# Altium project KeyBoardV2.PrjPcb
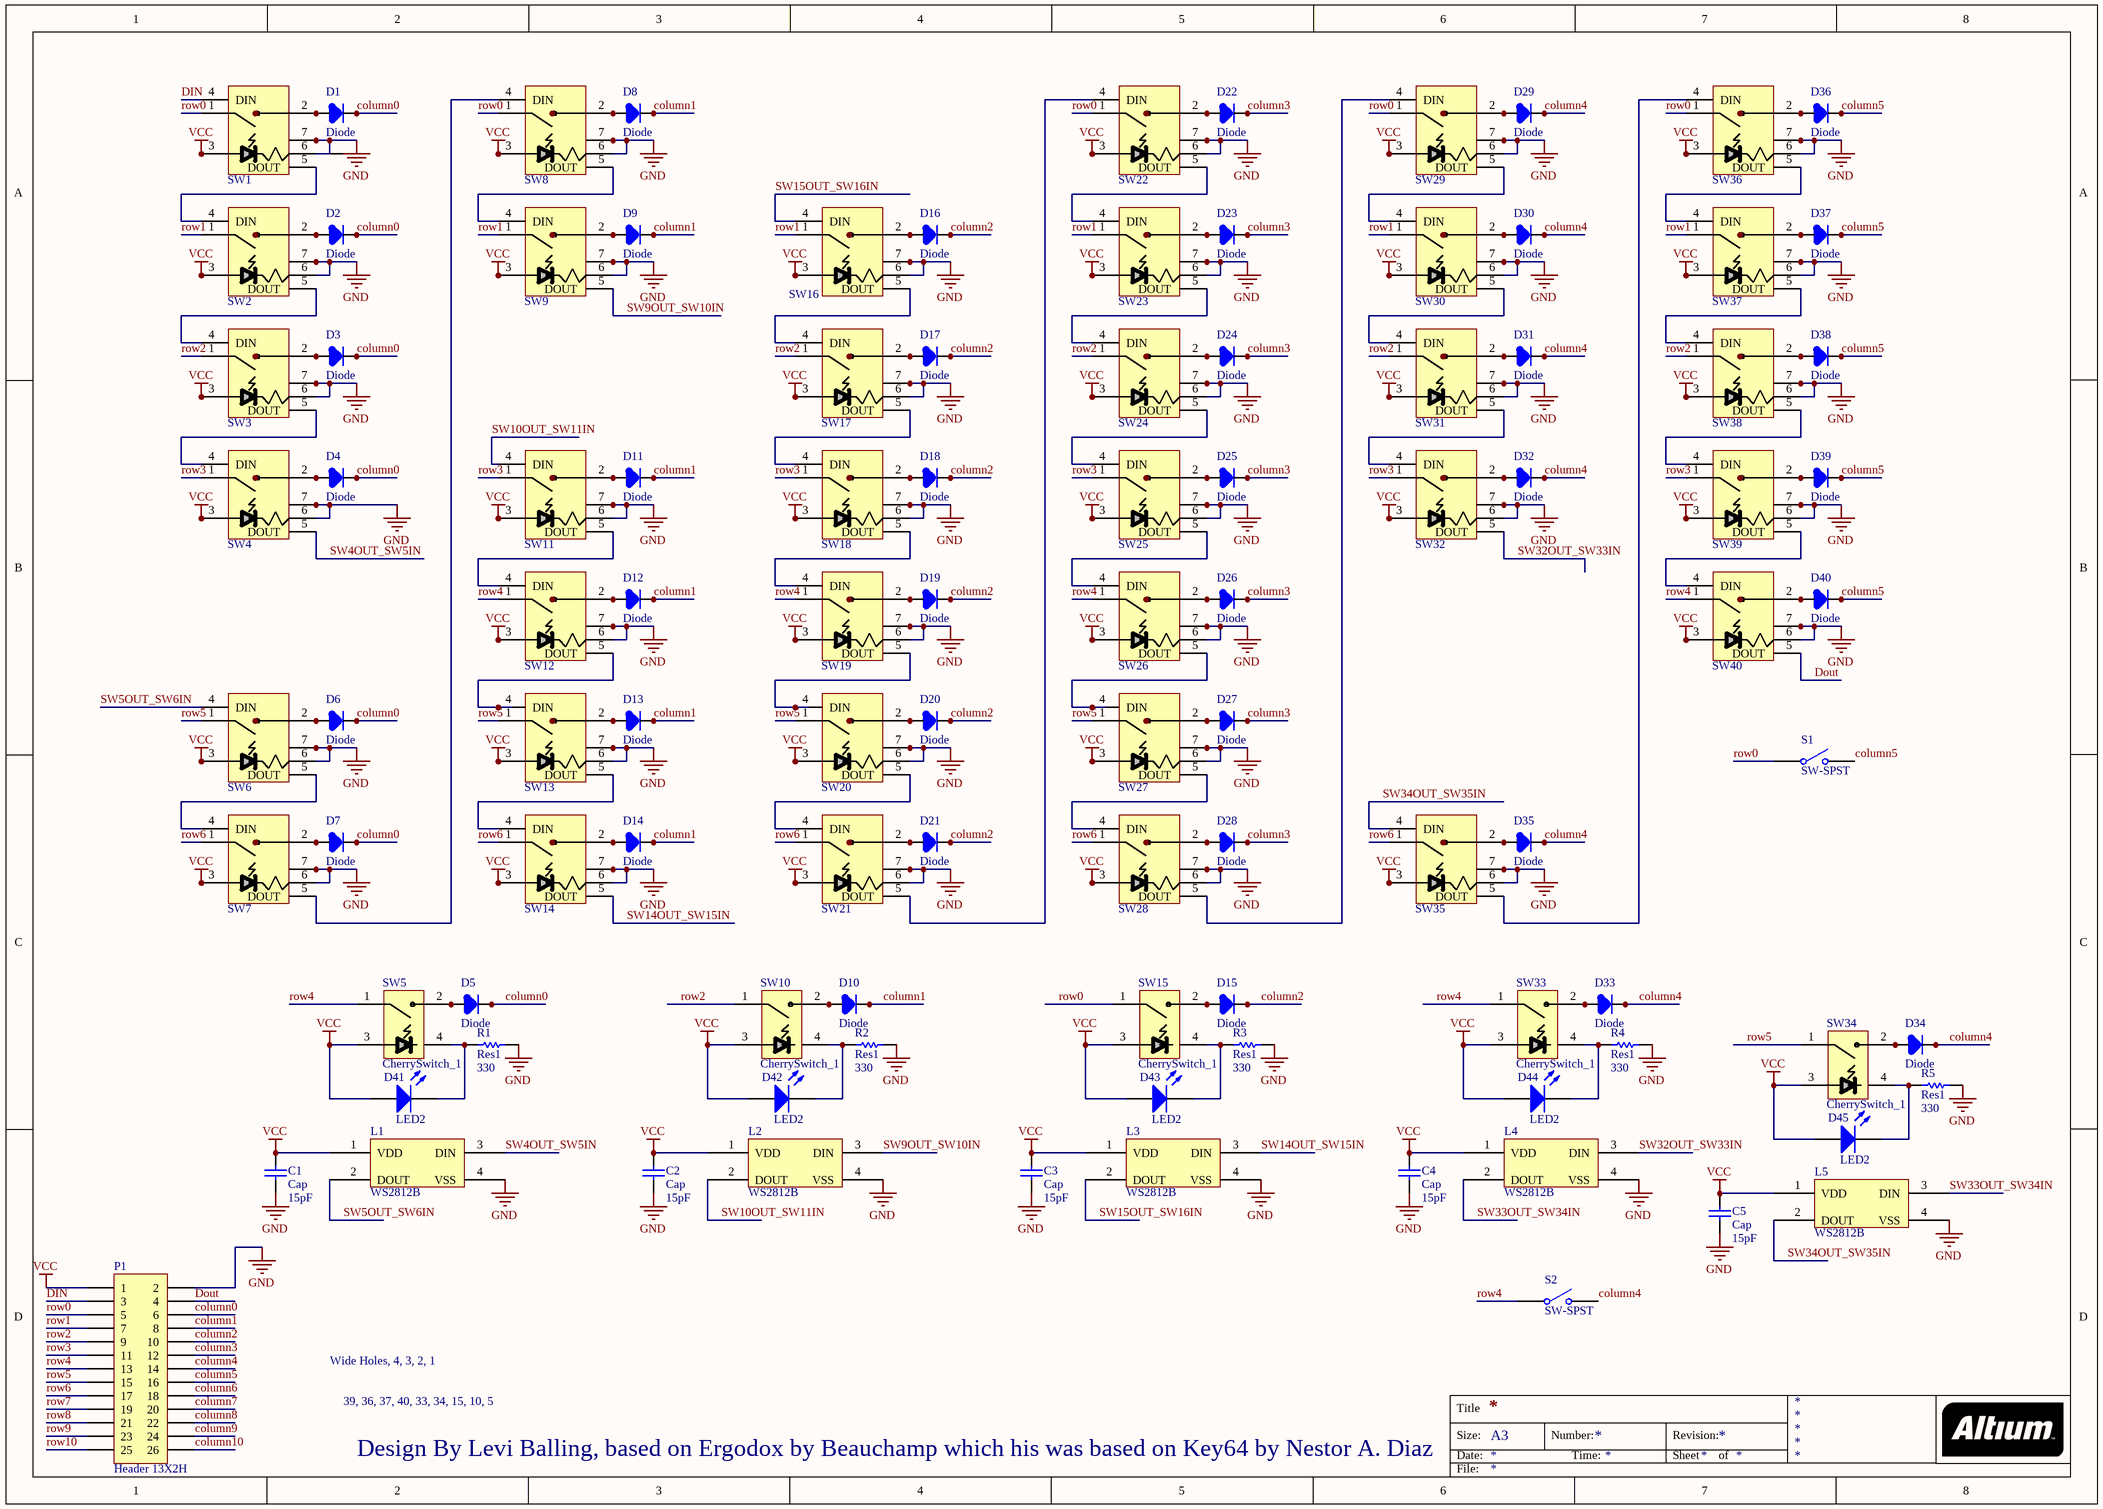
[diagram p0: keyboard.SchDoc]
1 sheet, 103 parts. Net scope: global (net labels, ports and power ports of the same name join across sheets).
Board file: Mickeyboard2.PcbDoc

## Sheet keyboard.SchDoc
size A3

### Parts
C1  Cap  value 15pF  [AxialSMDCap]
C2  Cap  value 15pF  [AxialSMDCap]
C3  Cap  value 15pF  [AxialSMDCap]
C4  Cap  value 15pF  [AxialSMDCap]
C5  Cap  value 15pF  [AxialSMDCap]
D1  Diode  [AxialSMDDiode]
D2  Diode  [AxialSMDDiode]
D3  Diode  [AxialSMDDiode]
D4  Diode  [AxialSMDDiode]
D5  Diode  [AxialSMDDiode]
D6  Diode  [AxialSMDDiode]
D7  Diode  [AxialSMDDiode]
D8  Diode  [AxialSMDDiode]
D9  Diode  [AxialSMDDiode]
D10  Diode  [AxialSMDDiode]
D11  Diode  [AxialSMDDiode]
D12  Diode  [AxialSMDDiode]
D13  Diode  [AxialSMDDiode]
D14  Diode  [AxialSMDDiode]
D15  Diode  [AxialSMDDiode]
D16  Diode  [AxialSMDDiode]
D17  Diode  [AxialSMDDiode]
D18  Diode  [AxialSMDDiode]
D19  Diode  [AxialSMDDiode]
D20  Diode  [AxialSMDDiode]
D21  Diode  [AxialSMDDiode]
D22  Diode  [AxialSMDDiode]
D23  Diode  [AxialSMDDiode]
D24  Diode  [AxialSMDDiode]
D25  Diode  [AxialSMDDiode]
D26  Diode  [AxialSMDDiode]
D27  Diode  [AxialSMDDiode]
D28  Diode  [AxialSMDDiode]
D29  Diode  [AxialSMDDiode]
D30  Diode  [AxialSMDDiode]
D31  Diode  [AxialSMDDiode]
D32  Diode  [AxialSMDDiode]
D33  Diode  [AxialSMDDiode]
D34  Diode  [AxialSMDDiode]
D35  Diode  [AxialSMDDiode]
D36  Diode  [AxialSMDDiode]
D37  Diode  [AxialSMDDiode]
D38  Diode  [AxialSMDDiode]
D39  Diode  [AxialSMDDiode]
D40  Diode  [AxialSMDDiode]
D41  LED2  [0805_LED]
D42  LED2  [0805_LED]
D43  LED2  [0805_LED]
D44  LED2  [0805_LED]
D45  LED2  [0805_LED]
L1  WS2812B  [WS2812]
L2  WS2812B  [WS2812]
L3  WS2812B  [WS2812]
L4  WS2812B  [WS2812]
L5  WS2812B  [WS2812]
P1  Header 13X2H  [HDR2X13H]
R1  Res1  value 330  [AxialSMDResistor]
R2  Res1  value 330  [AxialSMDResistor]
R3  Res1  value 330  [AxialSMDResistor]
R4  Res1  value 330  [AxialSMDResistor]
R5  Res1  value 330  [AxialSMDResistor]
S1  SW-SPST  [CherryMxSwitchNoLED]
S2  SW-SPST  [CherryMxSwitchNoLED]
SW1  CherrySwitch_WS  [CherryMxSwitchLED_WS2812]  (value not drawn)
SW2  CherrySwitch_WS  [CherryMxSwitchLED_WS2812]  (value not drawn)
SW3  CherrySwitch_WS  [CherryMxSwitchLED_WS2812]  (value not drawn)
SW4  CherrySwitch_WS  [CherryMxSwitchLED_WS2812]  (value not drawn)
SW5  CherrySwitch_1  [CherryMxSwitchNOSMD]
SW6  CherrySwitch_WS  [CherryMxSwitchLED_WS2812]  (value not drawn)
SW7  CherrySwitch_WS  [CherryMxSwitchLED_WS2812]  (value not drawn)
SW8  CherrySwitch_WS  [CherryMxSwitchLED_WS2812]  (value not drawn)
SW9  CherrySwitch_WS  [CherryMxSwitchLED_WS2812]  (value not drawn)
SW10  CherrySwitch_1  [CherryMxSwitchNOSMD]
SW11  CherrySwitch_WS  [CherryMxSwitchLED_WS2812]  (value not drawn)
SW12  CherrySwitch_WS  [CherryMxSwitchLED_WS2812]  (value not drawn)
SW13  CherrySwitch_WS  [CherryMxSwitchLED_WS2812]  (value not drawn)
SW14  CherrySwitch_WS  [CherryMxSwitchLED_WS2812]  (value not drawn)
SW15  CherrySwitch_1  [CherryMxSwitchNOSMD]
SW16  CherrySwitch_WS  [CherryMxSwitchLED_WS2812]  (value not drawn)
SW17  CherrySwitch_WS  [CherryMxSwitchLED_WS2812]  (value not drawn)
SW18  CherrySwitch_WS  [CherryMxSwitchLED_WS2812]  (value not drawn)
SW19  CherrySwitch_WS  [CherryMxSwitchLED_WS2812]  (value not drawn)
SW20  CherrySwitch_WS  [CherryMxSwitchLED_WS2812]  (value not drawn)
SW21  CherrySwitch_WS  [CherryMxSwitchLED_WS2812]  (value not drawn)
SW22  CherrySwitch_WS  [CherryMxSwitchLED_WS2812]  (value not drawn)
SW23  CherrySwitch_WS  [CherryMxSwitchLED_WS2812]  (value not drawn)
SW24  CherrySwitch_WS  [CherryMxSwitchLED_WS2812]  (value not drawn)
SW25  CherrySwitch_WS  [CherryMxSwitchLED_WS2812]  (value not drawn)
SW26  CherrySwitch_WS  [CherryMxSwitchLED_WS2812]  (value not drawn)
SW27  CherrySwitch_WS  [CherryMxSwitchLED_WS2812]  (value not drawn)
SW28  CherrySwitch_WS  [CherryMxSwitchLED_WS2812]  (value not drawn)
SW29  CherrySwitch_WS  [CherryMxSwitchLED_WS2812]  (value not drawn)
SW30  CherrySwitch_WS  [CherryMxSwitchLED_WS2812]  (value not drawn)
SW31  CherrySwitch_WS  [CherryMxSwitchLED_WS2812]  (value not drawn)
SW32  CherrySwitch_WS  [CherryMxSwitchLED_WS2812]  (value not drawn)
SW33  CherrySwitch_1  [CherryMxSwitchNOSMD]
SW34  CherrySwitch_1  [CherryMxSwitchNOSMD]
SW35  CherrySwitch_WS  [CherryMxSwitchLED_WS2812]  (value not drawn)
SW36  CherrySwitch_WS  [CherryMxSwitchLED_WS2812]  (value not drawn)
SW37  CherrySwitch_WS  [CherryMxSwitchLED_WS2812]  (value not drawn)
SW38  CherrySwitch_WS  [CherryMxSwitchLED_WS2812]  (value not drawn)
SW39  CherrySwitch_WS  [CherryMxSwitchLED_WS2812]  (value not drawn)
SW40  CherrySwitch_WS  [CherryMxSwitchLED_WS2812]  (value not drawn)

### Nets
6: SW2.8 SW3.8 SW4.8 SW6.8 SW7.8 SW8.8 SW9.8 SW11.8 SW12.8 SW13.8 SW14.8 SW16.8 SW17.8 SW18.8 SW19.8 SW20.8 SW21.8 SW22.8 SW23.8 SW24.8 SW25.8 SW26.8 SW27.8 SW28.8 SW29.8 SW30.8 SW31.8 SW32.8 SW35.8 SW36.8 SW37.8 SW38.8 SW39.8 SW40.8
GND: C1.1 C2.1 C3.1 C4.1 C5.1 L1.4(VSS) L2.4(VSS) L3.4(VSS) L4.4(VSS) L5.4(VSS) P1.2 R1.2 R2.2 R3.2 R4.2 R5.2 SW1.6(GND) SW1.7(GND) SW1.17 SW1.18 SW2.6(GND) SW2.7(GND) SW2.17 SW2.18 SW3.6(GND) SW3.7(GND) SW3.17 SW3.18 SW4.6(GND) SW4.7(GND) SW4.17 SW4.18 SW6.6(GND) SW6.7(GND) SW6.17 SW6.18 SW7.6(GND) SW7.7(GND) SW7.17 SW7.18 SW8.6(GND) SW8.7(GND) SW8.17 SW8.18 SW9.6(GND) SW9.7(GND) SW9.17 SW9.18 SW11.6(GND) SW11.7(GND) SW11.17 SW11.18 SW12.6(GND) SW12.7(GND) SW12.17 SW12.18 SW13.6(GND) SW13.7(GND) SW13.17 SW13.18 SW14.6(GND) SW14.7(GND) SW14.17 SW14.18 SW16.6(GND) SW16.7(GND) SW16.17 SW16.18 SW17.6(GND) SW17.7(GND) SW17.17 SW17.18 SW18.6(GND) SW18.7(GND) SW18.17 SW18.18 SW19.6(GND) SW19.7(GND) SW19.17 SW19.18 SW20.6(GND) SW20.7(GND) SW20.17 SW20.18 SW21.6(GND) SW21.7(GND) SW21.17 SW21.18 SW22.6(GND) SW22.7(GND) SW22.17 SW22.18 SW23.6(GND) SW23.7(GND) SW23.17 SW23.18 SW24.6(GND) SW24.7(GND) SW24.17 SW24.18 SW25.6(GND) SW25.7(GND) SW25.17 SW25.18 SW26.6(GND) SW26.7(GND) SW26.17 SW26.18 SW27.6(GND) SW27.7(GND) SW27.17 SW27.18 SW28.6(GND) SW28.7(GND) SW28.17 SW28.18 SW29.6(GND) SW29.7(GND) SW29.17 SW29.18 SW30.6(GND) SW30.7(GND) SW30.17 SW30.18 SW31.6(GND) SW31.7(GND) SW31.17 SW31.18 SW32.6(GND) SW32.7(GND) SW32.17 SW32.18 SW35.6(GND) SW35.7(GND) SW35.17 SW35.18 SW36.6(GND) SW36.7(GND) SW36.17 SW36.18 SW37.6(GND) SW37.7(GND) SW37.17 SW37.18 SW38.6(GND) SW38.7(GND) SW38.17 SW38.18 SW39.6(GND) SW39.7(GND) SW39.17 SW39.18 SW40.6(GND) SW40.7(GND) SW40.17 SW40.18
VCC: C1.2 C2.2 C3.2 C4.2 C5.2 D41.1(A) D42.1(A) D43.1(A) D44.1(A) D45.1(A) L1.1(VDD) L2.1(VDD) L3.1(VDD) L4.1(VDD) L5.1(VDD) P1.1 SW1.3 SW1.9 SW1.10 SW1.11 SW1.12 SW2.3 SW2.9 SW2.10 SW2.11 SW2.12 SW3.3 SW3.9 SW3.10 SW3.11 SW3.12 SW4.3 SW4.9 SW4.10 SW4.11 SW4.12 SW5.3 SW6.3 SW6.9 SW6.10 SW6.11 SW6.12 SW7.3 SW7.9 SW7.10 SW7.11 SW7.12 SW8.3 SW8.9 SW8.10 SW8.11 SW8.12 SW9.3 SW9.9 SW9.10 SW9.11 SW9.12 SW10.3 SW11.3 SW11.9 SW11.10 SW11.11 SW11.12 SW12.3 SW12.9 SW12.10 SW12.11 SW12.12 SW13.3 SW13.9 SW13.10 SW13.11 SW13.12 SW14.3 SW14.9 SW14.10 SW14.11 SW14.12 SW15.3 SW16.3 SW16.9 SW16.10 SW16.11 SW16.12 SW17.3 SW17.9 SW17.10 SW17.11 SW17.12 SW18.3 SW18.9 SW18.10 SW18.11 SW18.12 SW19.3 SW19.9 SW19.10 SW19.11 SW19.12 SW20.3 SW20.9 SW20.10 SW20.11 SW20.12 SW21.3 SW21.9 SW21.10 SW21.11 SW21.12 SW22.3 SW22.9 SW22.10 SW22.11 SW22.12 SW23.3 SW23.9 SW23.10 SW23.11 SW23.12 SW24.3 SW24.9 SW24.10 SW24.11 SW24.12 SW25.3 SW25.9 SW25.10 SW25.11 SW25.12 SW26.3 SW26.9 SW26.10 SW26.11 SW26.12 SW27.3 SW27.9 SW27.10 SW27.11 SW27.12 SW28.3 SW28.9 SW28.10 SW28.11 SW28.12 SW29.3 SW29.9 SW29.10 SW29.11 SW29.12 SW30.3 SW30.9 SW30.10 SW30.11 SW30.12 SW31.3 SW31.9 SW31.10 SW31.11 SW31.12 SW32.3 SW32.9 SW32.10 SW32.11 SW32.12 SW33.3 SW34.3 SW35.3 SW35.9 SW35.10 SW35.11 SW35.12 SW36.3 SW36.9 SW36.10 SW36.11 SW36.12 SW37.3 SW37.9 SW37.10 SW37.11 SW37.12 SW38.3 SW38.9 SW38.10 SW38.11 SW38.12 SW39.3 SW39.9 SW39.10 SW39.11 SW39.12 SW40.3 SW40.9 SW40.10 SW40.11 SW40.12
column0: D1.2 D1.4 D2.2 D2.4 D3.2 D3.4 D4.2 D4.4 D5.2 D5.4 D6.2 D6.4 D7.2 D7.4 P1.6
column1: D8.2 D8.4 D9.2 D9.4 D10.2 D10.4 D11.2 D11.4 D12.2 D12.4 D13.2 D13.4 D14.2 D14.4 P1.8
column2: D15.2 D15.4 D16.2 D16.4 D17.2 D17.4 D18.2 D18.4 D19.2 D19.4 D20.2 D20.4 D21.2 D21.4 P1.10
column3: D22.2 D22.4 D23.2 D23.4 D24.2 D24.4 D25.2 D25.4 D26.2 D26.4 D27.2 D27.4 D28.2 D28.4 P1.12
column4: D29.2 D29.4 D30.2 D30.4 D31.2 D31.4 D32.2 D32.4 D33.2 D33.4 D34.2 D34.4 D35.2 D35.4 P1.14 S2.2(NO)
column5: D36.2 D36.4 D37.2 D37.4 D38.2 D38.4 D39.2 D39.4 D40.2 D40.4 P1.16 S1.2(NO)
column6: P1.18
column7: P1.20
column8: P1.22
column9: P1.24
column10: P1.26
DIN: P1.3 SW1.4(DIN)
Dout: P1.4 SW40.5(DOUT)
row0: P1.5 S1.1(COMMON) SW1.1 SW8.1 SW15.1 SW22.1 SW29.1 SW36.1
row1: P1.7 SW2.1 SW9.1 SW16.1 SW23.1 SW30.1 SW37.1
row2: P1.9 SW3.1 SW10.1 SW17.1 SW24.1 SW31.1 SW38.1
row3: P1.11 SW4.1 SW11.1 SW18.1 SW25.1 SW32.1 SW39.1
row4: P1.13 S2.1(COMMON) SW5.1 SW12.1 SW19.1 SW26.1 SW33.1 SW40.1
row5: P1.15 SW6.1 SW13.1 SW20.1 SW27.1 SW34.1
row6: P1.17 SW7.1 SW14.1 SW21.1 SW28.1 SW35.1
row7: P1.19
row8: P1.21
row9: P1.23
row10: P1.25
SW4OUT_SW5IN: L1.3(DIN) SW4.5(DOUT)
SW5OUT_SW6IN: L1.2(DOUT) SW6.4(DIN)
SW9OUT_SW10IN: L2.3(DIN) SW9.5(DOUT)
SW10OUT_SW11IN: L2.2(DOUT) SW11.4(DIN)
SW14OUT_SW15IN: L3.3(DIN) SW14.5(DOUT)
SW15OUT_SW16IN: L3.2(DOUT) SW16.4(DIN)
SW32OUT_SW33IN: L4.3(DIN) SW32.5(DOUT)
SW33OUT_SW34IN: L4.2(DOUT) L5.3(DIN)
SW34OUT_SW35IN: L5.2(DOUT) SW35.4(DIN)
NetD1_1: D1.1 D1.3 SW1.2
NetD2_1: D2.1 D2.3 SW2.2
NetD3_1: D3.1 D3.3 SW3.2
NetD4_1: D4.1 D4.3 SW4.2
NetD5_1: D5.1 D5.3 SW5.2
NetD6_1: D6.1 D6.3 SW6.2
NetD7_1: D7.1 D7.3 SW7.2
NetD8_1: D8.1 D8.3 SW8.2
NetD9_1: D9.1 D9.3 SW9.2
NetD10_1: D10.1 D10.3 SW10.2
NetD11_1: D11.1 D11.3 SW11.2
NetD12_1: D12.1 D12.3 SW12.2
NetD13_1: D13.1 D13.3 SW13.2
NetD14_1: D14.1 D14.3 SW14.2
NetD15_1: D15.1 D15.3 SW15.2
NetD16_1: D16.1 D16.3 SW16.2
NetD17_1: D17.1 D17.3 SW17.2
NetD18_1: D18.1 D18.3 SW18.2
NetD19_1: D19.1 D19.3 SW19.2
NetD20_1: D20.1 D20.3 SW20.2
NetD21_1: D21.1 D21.3 SW21.2
NetD22_1: D22.1 D22.3 SW22.2
NetD23_1: D23.1 D23.3 SW23.2
NetD24_1: D24.1 D24.3 SW24.2
NetD25_1: D25.1 D25.3 SW25.2
NetD26_1: D26.1 D26.3 SW26.2
NetD27_1: D27.1 D27.3 SW27.2
NetD28_1: D28.1 D28.3 SW28.2
NetD29_1: D29.1 D29.3 SW29.2
NetD30_1: D30.1 D30.3 SW30.2
NetD31_1: D31.1 D31.3 SW31.2
NetD32_1: D32.1 D32.3 SW32.2
NetD33_1: D33.1 D33.3 SW33.2
NetD34_1: D34.1 D34.3 SW34.2
NetD35_1: D35.1 D35.3 SW35.2
NetD36_1: D36.1 D36.3 SW36.2
NetD37_1: D37.1 D37.3 SW37.2
NetD38_1: D38.1 D38.3 SW38.2
NetD39_1: D39.1 D39.3 SW39.2
NetD40_1: D40.1 D40.3 SW40.2
NetD41_2: D41.2(K) R1.1 SW5.4
NetD42_2: D42.2(K) R2.1 SW10.4
NetD43_2: D43.2(K) R3.1 SW15.4
NetD44_2: D44.2(K) R4.1 SW33.4
NetD45_2: D45.2(K) R5.1 SW34.4
NetSW1_5: SW1.5(DOUT) SW2.4(DIN)
NetSW1_13: SW1.13 SW1.14 SW1.15 SW1.16
NetSW2_5: SW2.5(DOUT) SW3.4(DIN)
NetSW2_13: SW2.13 SW2.14 SW2.15 SW2.16
NetSW3_5: SW3.5(DOUT) SW4.4(DIN)
NetSW3_13: SW3.13 SW3.14 SW3.15 SW3.16
NetSW4_13: SW4.13 SW4.14 SW4.15 SW4.16
NetSW6_5: SW6.5(DOUT) SW7.4(DIN)
NetSW6_13: SW6.13 SW6.14 SW6.15 SW6.16
NetSW7_5: SW7.5(DOUT) SW8.4(DIN)
NetSW7_13: SW7.13 SW7.14 SW7.15 SW7.16
NetSW8_5: SW8.5(DOUT) SW9.4(DIN)
NetSW8_13: SW8.13 SW8.14 SW8.15 SW8.16
NetSW9_13: SW9.13 SW9.14 SW9.15 SW9.16
NetSW11_5: SW11.5(DOUT) SW12.4(DIN)
NetSW11_13: SW11.13 SW11.14 SW11.15 SW11.16
NetSW12_5: SW12.5(DOUT) SW13.4(DIN)
NetSW12_13: SW12.13 SW12.14 SW12.15 SW12.16
NetSW13_5: SW13.5(DOUT) SW14.4(DIN)
NetSW13_13: SW13.13 SW13.14 SW13.15 SW13.16
NetSW14_13: SW14.13 SW14.14 SW14.15 SW14.16
NetSW16_5: SW16.5(DOUT) SW17.4(DIN)
NetSW16_13: SW16.13 SW16.14 SW16.15 SW16.16
NetSW17_5: SW17.5(DOUT) SW18.4(DIN)
NetSW17_13: SW17.13 SW17.14 SW17.15 SW17.16
NetSW18_5: SW18.5(DOUT) SW19.4(DIN)
NetSW18_13: SW18.13 SW18.14 SW18.15 SW18.16
NetSW19_5: SW19.5(DOUT) SW20.4(DIN)
NetSW19_13: SW19.13 SW19.14 SW19.15 SW19.16
NetSW20_5: SW20.5(DOUT) SW21.4(DIN)
NetSW20_13: SW20.13 SW20.14 SW20.15 SW20.16
NetSW21_5: SW21.5(DOUT) SW22.4(DIN)
NetSW21_13: SW21.13 SW21.14 SW21.15 SW21.16
NetSW22_5: SW22.5(DOUT) SW23.4(DIN)
NetSW22_13: SW22.13 SW22.14 SW22.15 SW22.16
NetSW23_5: SW23.5(DOUT) SW24.4(DIN)
NetSW23_13: SW23.13 SW23.14 SW23.15 SW23.16
NetSW24_5: SW24.5(DOUT) SW25.4(DIN)
NetSW24_13: SW24.13 SW24.14 SW24.15 SW24.16
NetSW25_5: SW25.5(DOUT) SW26.4(DIN)
NetSW25_13: SW25.13 SW25.14 SW25.15 SW25.16
NetSW26_5: SW26.5(DOUT) SW27.4(DIN)
NetSW26_13: SW26.13 SW26.14 SW26.15 SW26.16
NetSW27_5: SW27.5(DOUT) SW28.4(DIN)
NetSW27_13: SW27.13 SW27.14 SW27.15 SW27.16
NetSW28_5: SW28.5(DOUT) SW29.4(DIN)
NetSW28_13: SW28.13 SW28.14 SW28.15 SW28.16
NetSW29_5: SW29.5(DOUT) SW30.4(DIN)
NetSW29_13: SW29.13 SW29.14 SW29.15 SW29.16
NetSW30_5: SW30.5(DOUT) SW31.4(DIN)
NetSW30_13: SW30.13 SW30.14 SW30.15 SW30.16
NetSW31_5: SW31.5(DOUT) SW32.4(DIN)
NetSW31_13: SW31.13 SW31.14 SW31.15 SW31.16
NetSW32_13: SW32.13 SW32.14 SW32.15 SW32.16
NetSW35_5: SW35.5(DOUT) SW36.4(DIN)
NetSW35_13: SW35.13 SW35.14 SW35.15 SW35.16
NetSW36_5: SW36.5(DOUT) SW37.4(DIN)
NetSW36_13: SW36.13 SW36.14 SW36.15 SW36.16
NetSW37_5: SW37.5(DOUT) SW38.4(DIN)
NetSW37_13: SW37.13 SW37.14 SW37.15 SW37.16
NetSW38_5: SW38.5(DOUT) SW39.4(DIN)
NetSW38_13: SW38.13 SW38.14 SW38.15 SW38.16
NetSW39_5: SW39.5(DOUT) SW40.4(DIN)
NetSW39_13: SW39.13 SW39.14 SW39.15 SW39.16
NetSW40_13: SW40.13 SW40.14 SW40.15 SW40.16

Not connected (* = marked no-connect by the designer): SW1 8

### Notes on the sheet
- Wide Holes, 4, 3, 2, 1
- 39, 36, 37, 40, 33, 34, 15, 10, 5
- Design By Levi Balling, based on Ergodox by Beauchamp which his was based on Key64 by Nestor A. Diaz
- Title
- Size:
- Date:
- A3
- Number:
- Time:
- Revision:
- Sheet
- of
- File:

### Library data of the parts
C1-C5 = Cap: Capacitor; Published: 8-Jun-2000; LatestRevisionDate: 17-Jul-2002; LatestRevisionNote: Re-released for DXP Platform.; PackageReference: RAD-0.3; Publisher: Altium Limited; PackageDescription: Radial Cap, Thru-Hole; 2 Leads; 0.3 in Pin Spacing
D41-D45 = LED2: Typical RED, GREEN, YELLOW, AMBER GaAs LED; Published: 8-Jun-2000; LatestRevisionDate: 17-Jul-2002; LatestRevisionNote: Re-released for DXP Platform.; PackageVersion: Feb-2002; PackageReference: 3.2X1.6X1.1; Publisher: Altium Limited; PackageDescription: SM LED; 2 Flat Leads
P1 = Header 13X2H: Header, 13-Pin, Dual row, Right Angle; LatestRevisionDate: 17-Jul-2002; LatestRevisionNote: Re-released for DXP Platform.; Publisher: Altium Limited
R1-R5 = Res1: Resistor; Published: 8-Jun-2000; LatestRevisionDate: 17-Jul-2002; LatestRevisionNote: Re-released for DXP Platform.; PackageReference: AXIAL-0.3; Publisher: Altium Limited; PackageDescription: Axial Device, Thru-Hole; 2 Leads; 0.3 in Pin Spacing
S1 S2 = SW-SPST: Single-Pole, Single-Throw Switch; Published: 24-Mar-1999; LatestRevisionDate: 17-Jul-2002; LatestRevisionNote: Re-released for DXP Platform.; PackageReference: SPST-2; Publisher: Altium Limited; PackageDescription: Switch; 2 Leads
SW1-SW4 SW6-SW9 SW11-SW14 SW16-SW32 SW35-SW40 = CherrySwitch_WS: Cherry MX Switch layout With WS2812, LED, Cap, and Res
SW5 SW10 SW15 SW33 SW34 = CherrySwitch_1: Cherry MX Switch With Through hole LED